# Altium schematic sheet SDC_4.SchDoc
size 420 x 297 mm; PageSetup: Record=PageOptions|CenterHorizontal=False|CenterVertical=False|PrintScale=0.95|XCorrection=0.00|YCorrection=0.00|PrintKind=1|BorderSize=5000000|LeftOffset=0|BottomOffset=0|Orientation=1|PaperLength=1000|PaperWidth=1000|Scale=100|PaperSource=15|PrintQuality=600|MediaType=1|DitherType=10|PaperKind=A4|PrintScaleMode=1
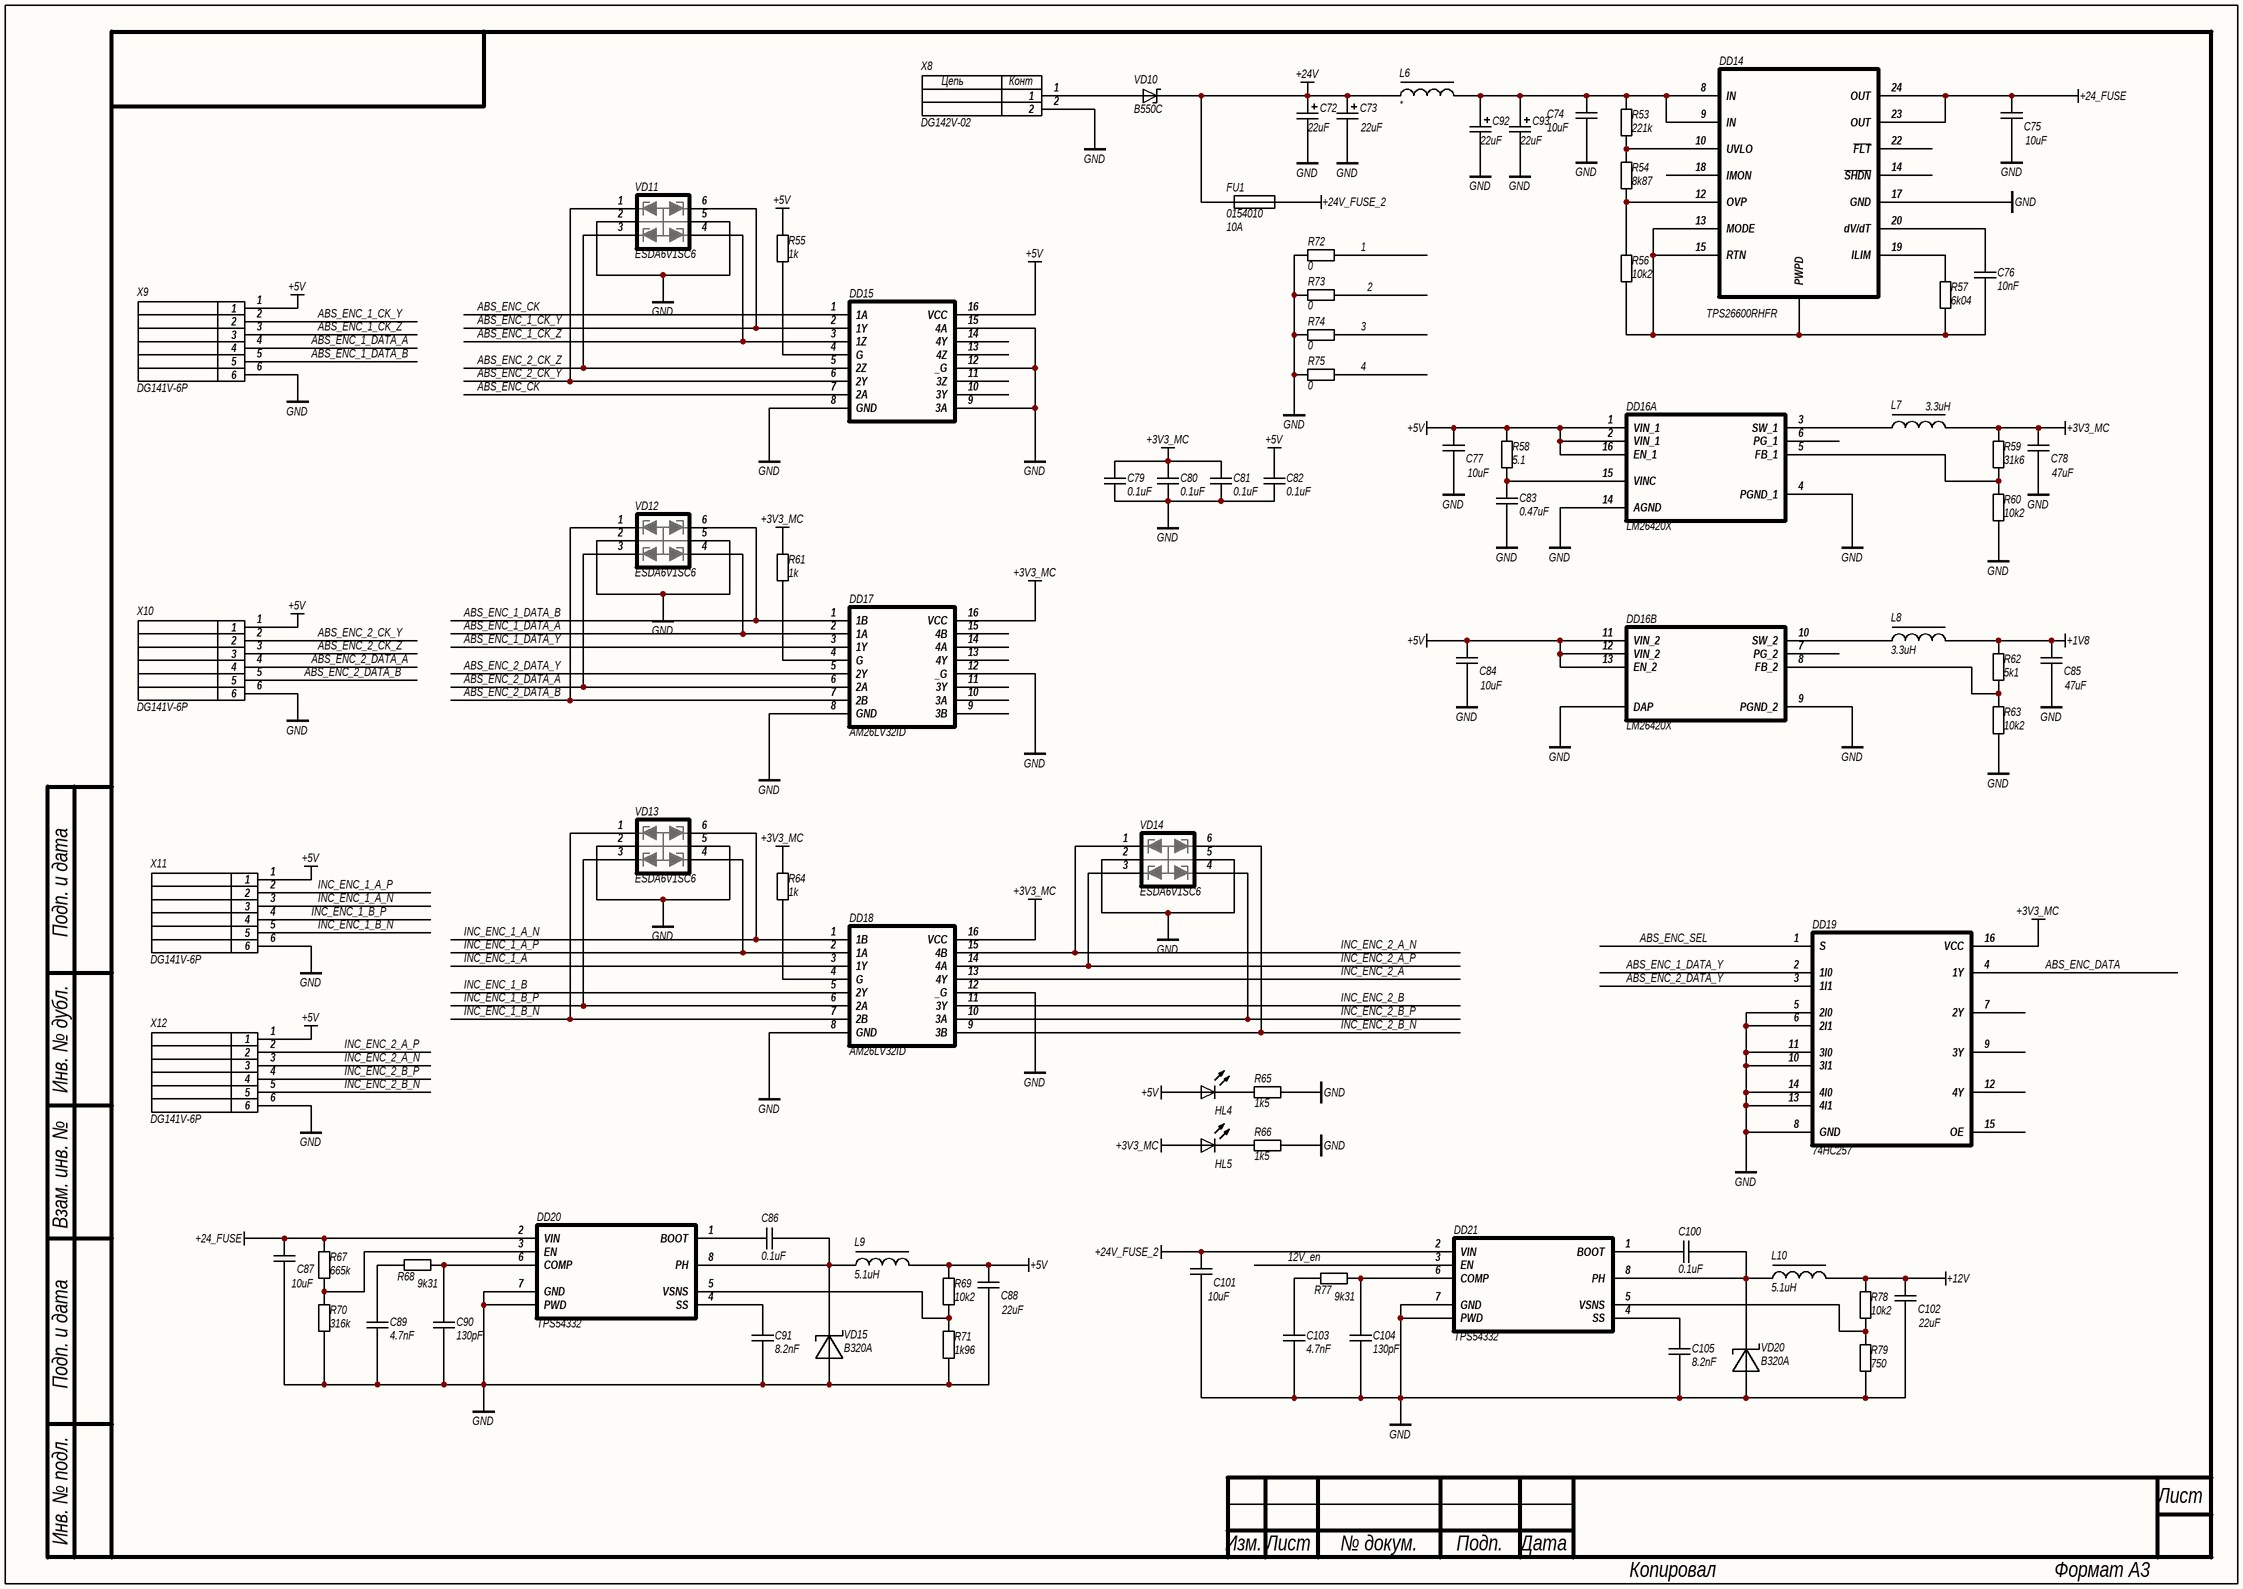
[diagram p0: SDC_4.SchDoc]

## Parts
C72  value 22uF  [Cap_D]  (hidden comment: caseD)
C73  value 22uF  [Cap_D]  (hidden comment: caseD)
C74  value 10uF  [C1210]  (hidden comment: CAP)
C75  value 10uF  [C1210]  (hidden comment: CAP)
C76  value 10nF  [C0603]  (hidden comment: CAP)
C77  value 10uF  [C1210]  (hidden comment: CAP)
C78  value 47uF  [C1210]  (hidden comment: CAP)
C79  value 0.1uF  [C0603]  (hidden comment: CAP)
C80  value 0.1uF  [C0603]  (hidden comment: CAP)
C81  value 0.1uF  [C0603]  (hidden comment: CAP)
C82  value 0.1uF  [C0603]  (hidden comment: CAP)
C83  value 0.47uF  [C0603]  (hidden comment: CAP)
C84  value 10uF  [C1210]  (hidden comment: CAP)
C85  value 47uF  [C1210]  (hidden comment: CAP)
C86  value 0.1uF  [C0603]  (hidden comment: CAP)
C87  value 10uF  [C0805]  (hidden comment: CAP)
C88  value 22uF  [C1210]  (hidden comment: CAP)
C89  value 4.7nF  [C0603]  (hidden comment: CAP)
C90  value 130pF  [C0603]  (hidden comment: CAP)
C91  value 8.2nF  [C0603]  (hidden comment: CAP)
C92  value 22uF  [Cap_D]  (hidden comment: caseD)
C93  value 22uF  [Cap_D]  (hidden comment: caseD)
C100  value 0.1uF  [C0603]  (hidden comment: CAP)
C101  value 10uF  [C0805]  (hidden comment: CAP)
C102  value 22uF  [C1210]  (hidden comment: CAP)
C103  value 4.7nF  [C0603]  (hidden comment: CAP)
C104  value 130pF  [C0603]  (hidden comment: CAP)
C105  value 8.2nF  [C0603]  (hidden comment: CAP)
DD14  TPS26600RHFR  [VQFN24]
DD15  AM26C31CD  [SO-16_N]  (value not drawn)
DD16  LM26420X  [WQFN16]  (parts A,B of 2)
DD17  AM26LV32ID  [SO-16_N]
DD18  AM26LV32ID  [SO-16_N]
DD19  74HC257  [SO-16_N]
DD20  TPS54332  [DDA]
DD21  TPS54332  [DDA]
FU1  0154010  current: 10A  [omni_block_154]
HL4  LED0603  [LED0603]  (value not drawn)
HL5  LED0603  [LED0603]  (value not drawn)
L6  XAL6060  [XAL6060]  (value not drawn)
L7  value 3.3uH  [XAL4030]  (hidden comment: XAL4030)
L8  value 3.3uH  [XAL4030]  (hidden comment: XAL4030)
L9  value 5.1uH  [XAL5050]  (hidden comment: XAL5050)
L10  value 5.1uH  [XAL5050]  (hidden comment: XAL5050)
R53  value 221k  [R0603]  (hidden comment: RES)
R54  value 8k87  [R0603]  (hidden comment: RES)
R55  value 1k  [R0603]  (hidden comment: RES)
R56  value 10k2  [R0603]  (hidden comment: RES)
R57  value 6k04  [R0603]  (hidden comment: RES)
R58  value 5.1  [R0603]  (hidden comment: RES)
R59  value 31k6  [R0603]  (hidden comment: RES)
R60  value 10k2  [R0603]  (hidden comment: RES)
R61  value 1k  [R0603]  (hidden comment: RES)
R62  value 5k1  [R0603]  (hidden comment: RES)
R63  value 10k2  [R0603]  (hidden comment: RES)
R64  value 1k  [R0603]  (hidden comment: RES)
R65  value 1k5  [R0603]  (hidden comment: RES)
R66  value 1k5  [R0603]  (hidden comment: RES)
R67  value 665k  [R0603]  (hidden comment: RES)
R68  value 9k31  [R0603]  (hidden comment: RES)
R69  value 10k2  [R0603]  (hidden comment: RES)
R70  value 316k  [R0603]  (hidden comment: RES)
R71  value 1k96  [R0603]  (hidden comment: RES)
R72  value 0  [R0603]  (hidden comment: RES)
R73  value 0  [R0603]  (hidden comment: RES)
R74  value 0  [R0603]  (hidden comment: RES)
R75  value 0  [R0603]  (hidden comment: RES)
R77  value 9k31  [R0603]  (hidden comment: RES)
R78  value 10k2  [R0603]  (hidden comment: RES)
R79  value 750  [R0603]  (hidden comment: RES)
VD10  B550C  [SMC-DO214]
VD11  ESDA6V1SC6  [SOT23-6]
VD12  ESDA6V1SC6  [SOT23-6]
VD13  ESDA6V1SC6  [SOT23-6]
VD14  ESDA6V1SC6  [SOT23-6]
VD15  B320A  [SMA-DO214]
VD20  B320A  [SMA-DO214]
X8  DG142V-02  [DG142V-02]
X9  DG141V-6P  [DG141V-06P]
X10  DG141V-6P  [DG141V-06P]
X11  DG141V-6P  [DG141V-06P]
X12  DG141V-6P  [DG141V-06P]

## Nets
+1V8: C85.2 L8.2 R62.2
+3V3_MC: C78.2 C79.2 C80.2 C81.2 DD17.16(VCC) DD18.16(VCC) DD19.16(VCC) HL5.1(A) L7.2 R59.2 R61.2 R64.2
+5V: C77.2 C82.2 C84.2 C88.2 DD15.16(VCC) DD16.1(VIN_1) DD16.2(VIN_1) DD16.11(VIN_2) DD16.12(VIN_2) DD16.13(EN_2) DD16.16(EN_1) HL4.1(A) L9.2 R55.2 R58.2 R69.2 X9.1 X10.1 X11.1 X12.1
+12V: C102.2 L10.2 R78.2
+24_FUSE: C75.2 C87.2 DD14.23(OUT) DD14.24(OUT) DD20.2(VIN) R67.2
+24V: C72.1 C73.1 FU1.1 L6.1 VD10.2(K)
+24V_FUSE_2: C101.2 DD21.2(VIN) FU1.2
GND: C72.2 C73.2 C74.1 C75.1 C77.1 C78.1 C79.1 C80.1 C81.1 C82.1 C83.1 C84.1 C85.1 C87.1 C88.1 C89.1 C90.1 C91.1 C92.2 C93.2 C101.1 C102.1 C103.1 C104.1 C105.1 DD14.17(GND) DD15.8(GND) DD15.9(3A) DD15.12(_G) DD15.15(4A) DD16.4(PGND_1) DD16.9(PGND_2) DD16.14(AGND) DD16.17(DAP) DD17.8(GND) DD17.12(_G) DD18.8(GND) DD18.12(_G) DD19.5(2I0) DD19.6(2I1) DD19.8(GND) DD19.10(3I1) DD19.11(3I0) DD19.13(4I1) DD19.14(4I0) DD20.7(GND) DD20.9(PWD) DD21.7(GND) DD21.9(PWD) R60.1 R63.1 R65.1 R66.1 R70.1 R71.1 R72.2 R73.2 R74.2 R75.2 R79.1 VD11.2 VD11.5 VD12.2 VD12.5 VD13.2 VD13.5 VD14.2 VD14.5 VD15.1(A) VD20.1(A) X8.2 X9.6 X10.6 X11.6 X12.6
1: R72.1
2: R73.1
3: R74.1
4: R75.1
12V_en: DD21.3(EN)
ABS_ENC_1_CK_Y: DD15.2(1Y) VD11.6 X9.2
ABS_ENC_1_CK_Z: DD15.3(1Z) VD11.4 X9.3
ABS_ENC_1_DATA_A: DD17.2(1A) VD12.4 X9.4
ABS_ENC_1_DATA_B: DD17.1(1B) VD12.6 X9.5
ABS_ENC_1_DATA_Y: DD17.3(1Y) DD19.2(1I0)
ABS_ENC_2_CK_Y: DD15.6(2Y) VD11.1 X10.2
ABS_ENC_2_CK_Z: DD15.5(2Z) VD11.3 X10.3
ABS_ENC_2_DATA_A: DD17.6(2A) VD12.3 X10.4
ABS_ENC_2_DATA_B: DD17.7(2B) VD12.1 X10.5
ABS_ENC_2_DATA_Y: DD17.5(2Y) DD19.3(1I1)
ABS_ENC_CK: DD15.1(1A) DD15.7(2A)
ABS_ENC_DATA: DD19.4(1Y)
ABS_ENC_SEL: DD19.1(S)
INC_ENC_1_A: DD18.3(1Y)
INC_ENC_1_A_N: DD18.1(1B) VD13.6 X11.3
INC_ENC_1_A_P: DD18.2(1A) VD13.4 X11.2
INC_ENC_1_B: DD18.5(2Y)
INC_ENC_1_B_N: DD18.7(2B) VD13.1 X11.5
INC_ENC_1_B_P: DD18.6(2A) VD13.3 X11.4
INC_ENC_2_A: DD18.13(4Y)
INC_ENC_2_A_N: DD18.15(4B) VD14.1 X12.3
INC_ENC_2_A_P: DD18.14(4A) VD14.3 X12.2
INC_ENC_2_B: DD18.11(3Y)
INC_ENC_2_B_N: DD18.9(3B) VD14.6 X12.5
INC_ENC_2_B_P: DD18.10(3A) VD14.4 X12.4
NetC74_2: C74.2 C92.1 C93.1 DD14.8(IN) DD14.9(IN) L6.2 R53.2
NetC76_1: C76.1 DD14.13(MODE) DD14.15(RTN) DD14.25(PWPD) R56.1 R57.1
NetC76_2: C76.2 DD14.20(dV/dT)
NetC83_2: C83.2 DD16.15(VINC) R58.1
NetC86_1: C86.1 DD20.8(PH) L9.1 VD15.2(K)
NetC86_2: C86.2 DD20.1(BOOT)
NetC89_2: C89.2 R68.2
NetC90_2: C90.2 DD20.6(COMP) R68.1
NetC91_2: C91.2 DD20.4(SS)
NetC100_1: C100.1 DD21.8(PH) L10.1 VD20.2(K)
NetC100_2: C100.2 DD21.1(BOOT)
NetC103_2: C103.2 R77.2
NetC104_2: C104.2 DD21.6(COMP) R77.1
NetC105_2: C105.2 DD21.4(SS)
NetDD14_10: DD14.10(UVLO) R53.1 R54.2
NetDD14_12: DD14.12(OVP) R54.1 R56.2
NetDD14_19: DD14.19(ILIM) R57.2
NetDD15_4: DD15.4(G) R55.1
NetDD16_3: DD16.3(SW_1) L7.1
NetDD16_5: DD16.5(FB_1) R59.1 R60.2
NetDD16_8: DD16.8(FB_2) R62.1 R63.2
NetDD16_10: DD16.10(SW_2) L8.1
NetDD17_4: DD17.4(G) R61.1
NetDD18_4: DD18.4(G) R64.1
NetDD20_3: DD20.3(EN) R67.1 R70.2
NetDD20_5: DD20.5(VSNS) R69.1 R71.2
NetDD21_5: DD21.5(VSNS) R78.1 R79.2
NetHL4_2: HL4.2(K) R65.2
NetHL5_2: HL5.2(K) R66.2
NetVD10_1: VD10.1(A) X8.1

Not connected (* = marked no-connect by the designer): DD14 14(~{SHDN}) 18(IMON) 22(~{FLT}); DD15 10(3Y) 11(3Z) 13(4Z) 14(4Y); DD16 6(PG_1) 7(PG_2); DD17 9(3B) 10(3A) 11(3Y) 13(4Y) 14(4A) 15(4B); DD19 7(2Y) 9(3Y) 12(4Y) 15(OE)

## Notes on the sheet
- Подп. и дата
- Инв. № дубл.
- Взам. инв. №
- Инв. № подл.
- Лист
- Изм.
- № докум.
- Подп.
- Дата
- Копировал
- Формат А3
- (in symbol DG142V-02) Цепь; Конт

## Library data of the parts
C72 C73 C92 C93 = Cap Pol_D: Polarized Capacitor (Surface Mount); voltage: 35V
C74-C76 C79-C83 C86 C87 C89-C91 C100 C101 C103-C105 = CAP: SMD Capacitor; Manufacturer: Murata; Material: X7R; Tolerance: 10%; Voltage: 50V; Type: Ceramic Capacitor
C77 C78 C84 C85 = CAP: SMD Capacitor; Manufacturer: Murata; Material: X7R; Tolerance: 10%; Voltage: 10V; Type: Ceramic Capacitor
C88 C102 = CAP: SMD Capacitor; Manufacturer: Murata; Material: X7R; Tolerance: 10%; Voltage: 25V; Type: Ceramic Capacitor
DD14 = TPS26600RHFR: Industrial eFuse; Current: 2A; Voltage: 60V; Name: TPS26600; Package: 16-Pin SOIC PowerPAD; Temperature Range: −40°C to + 125°C; Type: Industrial eFuse
DD15 = AM26C31CD: RS-422 transmitter
DD17 DD18 = AM26LV32ID: RS-422 receiver
DD19 = 74HC257: MUX
FU1 = 0154010: omni fuse block
L6 = XAL6060: chip inductor; value: *
L7 L8 = XAL4030: chip inductor
L9 L10 = XAL5050: chip inductor
R53-R75 R77-R79 = RES: SMD Resistor; Name: Chip SMD Resistor; Power: 0.062 Wt; Tolerance: 5%; Temperature Range: -55…155°C
VD10 = B550C: DIODE, SCHOTTKY, 5A, 50V, SMC
VD11-VD14 = ESDA6V1SC6: 4-line ESD protection
VD15 VD20 = B320A: Shottky diode
X9-X12 = DG141V-6P: wire connector